# Altium schematic sheet ProxSensPCB.SchDoc
size A; SheetNumber: 1; SheetTotal: 1
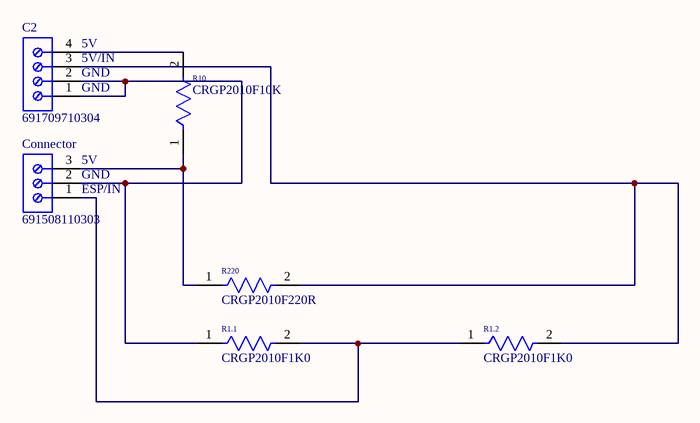
[diagram p0: ProxSensPCB.SchDoc]

## Parts
C2  691709710304  [691709710304]
Connector  691508110303  [691508110303]
R1.1  CRGP2010F1K0  [FP-CRGP2010-IPC_C]
R1.2  CRGP2010F1K0  [FP-CRGP2010-IPC_C]
R10  CRGP2010F10K  [FP-CRGP2010-IPC_C]
R220  CRGP2010F220R  [FP-CRGP2010-IPC_C]

## Nets
NetC2_1: C2.1 C2.2 Connector.2 R1.1.1
NetC2_3: C2.3 R1.2.2 R220.2
NetC2_4: C2.4 R10.2
NetConnector_1: Connector.1 R1.1.2 R1.2.1
NetConnector_3: Connector.3 R10.1 R220.1

## Notes on the sheet
- (near C2) 5V
- (near C2) GND
- (near C2) 5V/IN
- (near Connector) 5V
- (near Connector) GND
- (near Connector) ESP/IN

## Library data of the parts
C2 = CMP-1502-03337-2: NexarPartId: 34171771; Color: Black; Current: 6A; Voltage: 300V; Number of Positions Per Level: 4; Plating: Steel; Wire Gauge (Max): 30AWG; Pitch: 5mm; Connector Type: Screw; Number of Levels: 1; Lead Pitch: 5mm; Mount: Surface Mount; Flammability Rating: UL94 V-0; Termination: Screw; Housing Material: Nylon; Min Operating Temperature: -40°C; REACH SVHC: Unknown; Number of Pins: 4; Contact Plating: Tin; Packaging: Digi-Reel®; Height: 10.2mm; Number of Rows: 1; Number of Positions: 4; Contact Material: Nickel; Current Rating: 6A; Wire Gauge (Min): 30AWG; Voltage Rating: 300V; Length: 20mm; Wire/Cable Gauge: 30AWG; RoHS: Compliant; Number of Contacts: 4; Max Operating Temperature: 130°C
Connector = CMP-1502-02491-2: NexarPartId: 52645171; Plating: Brass, Steel, Tin; Current: 10A; Wire Gauge (Min): 16AWG; Voltage: 300V; Wire Gauge (Max): 30AWG; Number of Levels: 1; Number of Positions Per Level: 3; Pitch: 3.5mm; Min Operating Temperature: -40°C; Termination: Screw; Number of Pins: 3; Housing Material: Polymer; Length: 10.5mm; Mount: Surface Mount; Lead Pitch: 3.5mm; Contact Plating: Tin; Color: Black; RoHS: Compliant; Max Operating Temperature: 130°C
R1.1 R1.2 = CMP-03211-005910-1: CRGP2010 1KΩ 1.25W ±100ppm/°C 1% 400V; Manufacturer: TE; Tolerance: 0.01; Automotive: No; RoHS: TRUE; Ambient Temperature Range High: +70°C; Device Class L1: Passive Components; Octopart: https://octopart.com/crgp2010f1k0-te+connectivity-91018979; Package: CRGP2010; Manufacturer Part Number: CRGP2010F1K0; Voltage Rating: 400V; Resistance: 1KΩ; Temperature Range Low: -55°C; Series: CRGP; Device Class L3: Chip SMD Resistors; Temperature Range High: +155°C; Composition: Thick Film; Temperature: -55°C to +155°C; Lead Free: Yes; ComponentLink2URL: https://www.mouser.ca/datasheet/2/418/NG_DS_9-1773463-9_A-1358566.pdf; Ipc Land Pattern Name: RESC500250X55; Value: 1KΩ; ComponentLink2Description: Datasheet; Category: Res; Temperature Coefficient: ±100ppm/°C; Device Class L2: Resistors; Height: 0.65mm; Power Rating: 1.25W
R10 = CMP-03211-005831-1: CRGP2010 10KΩ 1.25W ±100ppm/°C 1% 400V; Manufacturer: TE; Tolerance: 0.01; Power Rating: 1.25W; RoHS: TRUE; Device Class L1: Passive Components; Manufacturer Part Number: CRGP2010F10K; Category: Res; Octopart: https://octopart.com/crgp2010f10k-te+connectivity-91018965; Automotive: No; Package: CRGP2010; Ambient Temperature Range High: +70°C; Temperature Range Low: -55°C; Height: 0.65mm; Device Class L2: Resistors; Voltage Rating: 400V; Series: CRGP; Value: 10KΩ; Temperature Range High: +155°C; Lead Free: Yes; Composition: Thick Film; Ipc Land Pattern Name: RESC500250X55; Temperature: -55°C to +155°C; Temperature Coefficient: ±100ppm/°C; ComponentLink2Description: Datasheet; ComponentLink2URL: https://www.mouser.ca/datasheet/2/418/NG_DS_9-1773463-9_A-1358566.pdf; Device Class L3: Chip SMD Resistors; Resistance: 10KΩ
R220 = CMP-03211-004746-1: CRGP2010 220Ω 1.25W ±100ppm/°C 1% 400V; Manufacturer: TE; Tolerance: 0.01; Temperature Coefficient: ±100ppm/°C; Package: CRGP2010; Temperature Range High: +155°C; Resistance: 220Ω; Height: 0.65mm; Series: CRGP; Octopart: https://octopart.com/crgp2010f220r-te+connectivity-91018985; Category: Res; Ambient Temperature Range High: +70°C; Temperature: -55°C to +155°C; Automotive: No; Device Class L2: Resistors; Voltage Rating: 400V; ComponentLink2URL: https://www.mouser.ca/datasheet/2/418/NG_DS_9-1773463-9_A-1358566.pdf; ComponentLink2Description: Datasheet; Device Class L3: Chip SMD Resistors; Power Rating: 1.25W; Value: 220Ω; Temperature Range Low: -55°C; Ipc Land Pattern Name: RESC500250X55; Manufacturer Part Number: CRGP2010F220R; RoHS: TRUE; Composition: Thick Film; Lead Free: Yes; Device Class L1: Passive Components